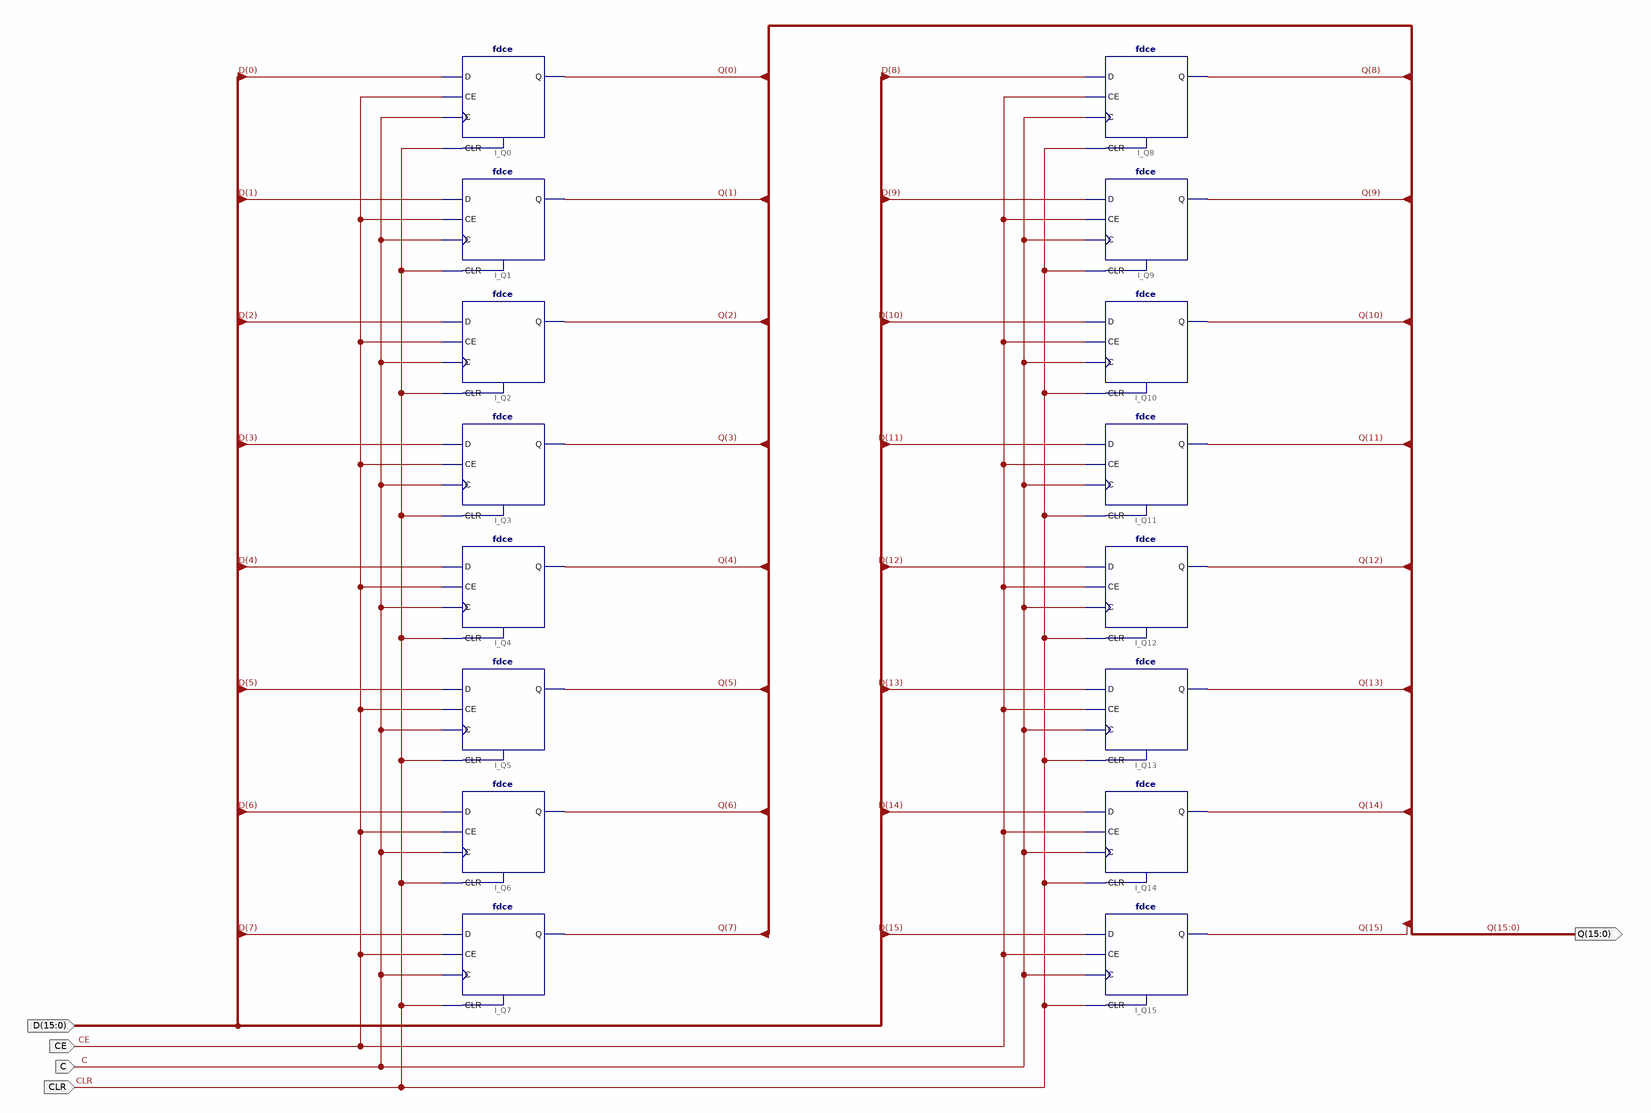
[diagram p0: schematic sheet 1]
// Xilinx ISE schematic Myfd16ce.sch (virtex4) as structural Verilog: 16 symbols, 5 ports
module Myfd16ce (
  input  CLR,
  input  C,
  input  CE,
  input  [15:0] D,
  output [15:0] Q
);

  fdce #(.RLOC("X0Y0")) I_Q0 (.C(C), .CE(CE), .CLR(CLR), .D(D[0]), .Q(Q[0]));
  fdce #(.RLOC("X0Y2")) I_Q5 (.C(C), .CE(CE), .CLR(CLR), .D(D[5]), .Q(Q[5]));
  fdce #(.RLOC("X0Y0")) I_Q1 (.C(C), .CE(CE), .CLR(CLR), .D(D[1]), .Q(Q[1]));
  fdce #(.RLOC("X0Y1")) I_Q2 (.C(C), .CE(CE), .CLR(CLR), .D(D[2]), .Q(Q[2]));
  fdce #(.RLOC("X0Y1")) I_Q3 (.C(C), .CE(CE), .CLR(CLR), .D(D[3]), .Q(Q[3]));
  fdce #(.RLOC("X0Y2")) I_Q4 (.C(C), .CE(CE), .CLR(CLR), .D(D[4]), .Q(Q[4]));
  fdce #(.RLOC("X0Y3")) I_Q6 (.C(C), .CE(CE), .CLR(CLR), .D(D[6]), .Q(Q[6]));
  fdce #(.RLOC("X0Y3")) I_Q7 (.C(C), .CE(CE), .CLR(CLR), .D(D[7]), .Q(Q[7]));
  fdce #(.RLOC("X0Y4")) I_Q8 (.C(C), .CE(CE), .CLR(CLR), .D(D[8]), .Q(Q[8]));
  fdce #(.RLOC("X0Y4")) I_Q9 (.C(C), .CE(CE), .CLR(CLR), .D(D[9]), .Q(Q[9]));
  fdce #(.RLOC("X0Y5")) I_Q10 (.C(C), .CE(CE), .CLR(CLR), .D(D[10]), .Q(Q[10]));
  fdce #(.RLOC("X0Y5")) I_Q11 (.C(C), .CE(CE), .CLR(CLR), .D(D[11]), .Q(Q[11]));
  fdce #(.RLOC("X0Y6")) I_Q12 (.C(C), .CE(CE), .CLR(CLR), .D(D[12]), .Q(Q[12]));
  fdce #(.RLOC("X0Y6")) I_Q13 (.C(C), .CE(CE), .CLR(CLR), .D(D[13]), .Q(Q[13]));
  fdce #(.RLOC("X0Y7")) I_Q14 (.C(C), .CE(CE), .CLR(CLR), .D(D[14]), .Q(Q[14]));
  fdce #(.RLOC("X0Y7")) I_Q15 (.C(C), .CE(CE), .CLR(CLR), .D(D[15]), .Q(Q[15]));
endmodule
